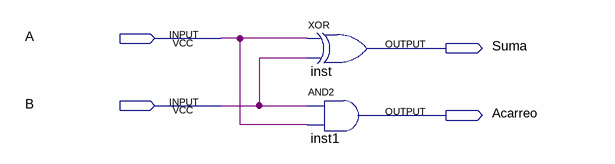
[diagram p0: schematic sheet]
// Quartus schematic SumadorChikito.bdf as structural Verilog: 2 symbols, 4 pins
module SumadorChikito (
  input  A,
  input  B,
  output Suma,
  output Acarreo
);

  xor inst (Suma, A, B);
  and inst1 (Acarreo, B, A);
endmodule
